# EAGLE schematic qPCR_pcb_breakout_SN74LVC1G04DBVR (EAGLE 9.6.1)
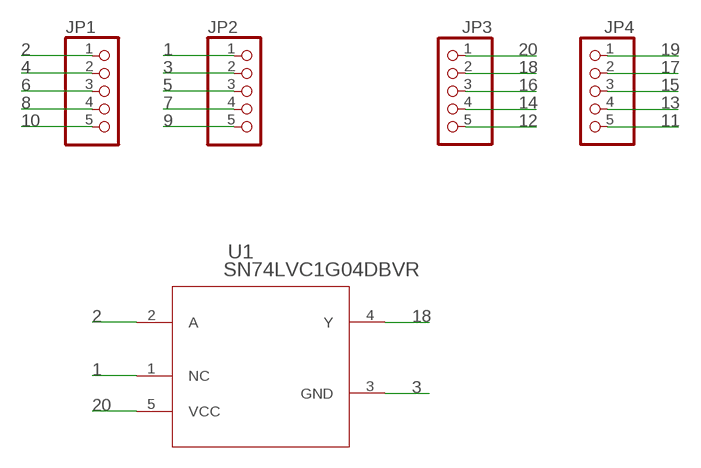
[diagram p0: schematic, sheet 1]

## Parts
JP1  PINHD-1X5R  [1X05R]
JP2  PINHD-1X5R  [1X05R]
JP3  PINHD-1X5R  [1X05R]
JP4  PINHD-1X5R  [1X05R]
U1  SN74LVC1G04DBVR  [DBV5]

## Nets
1: JP2.1 U1.1(NC)
2: JP1.1 U1.2(A)
3: JP2.2 U1.3(GND)
4: JP1.2
5: JP2.3
6: JP1.3
7: JP2.4
8: JP1.4
9: JP2.5
10: JP1.5
11: JP4.5
12: JP3.5
13: JP4.4
14: JP3.4
15: JP4.3
16: JP3.3
17: JP4.2
18: JP3.2 U1.4(Y)
19: JP4.1
20: JP3.1 U1.5(VCC)

## Library data of the parts
JP1-JP4 = pinhead:PINHD-1X5: PIN HEADER
U1 = Ninja_qPCR:SN74LVC1G04DBVR; DATASHEET_URL: http://www.ti.com/lit/gpn/SN74LVC1G04; DESCRIPTION: Single Inverter; FAMILY_NAME: LL INVERTER; GENERIC_PART_NUMBER: SN74LVC1G04; INDUSTRY_STD_PKG_TYPE: SOT-23; MANUFACTURER: Texas Instruments; MANUFACTURER_PART_NUMBER: SN74LVC1G04DBVR; PACKAGE_DESIGNATOR: DBV; PIN_COUNT: 5; VENDOR: Texas Instruments